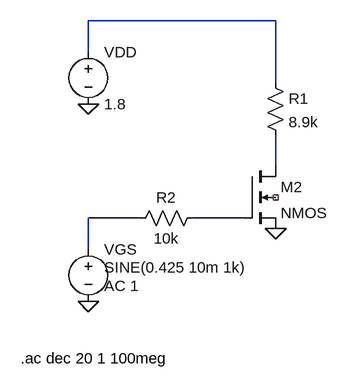
[diagram p0: schematic Common Source (CS) NMOS Amplifier.asc]
Common Source (CS) NMOS Amplifier.asc, the LTspice schematic file:
Version 4.1
SHEET 1 880 680
WIRE 160 -112 -128 -112
WIRE -128 -64 -128 -112
WIRE 160 -16 160 -112
WIRE 160 112 160 64
WIRE -48 192 -128 192
WIRE 112 192 32 192
WIRE -128 240 -128 192
FLAG 160 208 0
FLAG -128 320 0
FLAG -128 16 0
SYMBOL res 144 -32 R0
SYMATTR InstName R1
SYMATTR Value 8.9k
SYMBOL voltage -128 224 R0
WINDOW 3 24 44 Left 2
WINDOW 123 24 72 Left 2
WINDOW 39 24 100 Left 2
SYMATTR InstName VGS
SYMATTR Value SINE(0.425 10m 1k)
SYMATTR Value2 AC 1
SYMBOL voltage -128 -80 R0
WINDOW 123 0 0 Left 0
WINDOW 39 0 0 Left 0
SYMATTR InstName VDD
SYMATTR Value 1.8
SYMBOL nmos4 112 112 R0
SYMATTR InstName M2
SYMATTR Value2 l=0.18u w=10u
SYMBOL res 48 176 R90
WINDOW 0 0 56 VBottom 2
WINDOW 3 32 56 VTop 2
SYMATTR InstName R2
SYMATTR Value 10k
TEXT -232 408 Left 2 !.ac dec 20 1 100meg

The netlist it stands for:
* Common Source (CS) NMOS Amplifier.asc
R1 N001 N002 8.9k
VGS N003 0 SINE(0.425 10m 1k) AC 1
VDD N001 0 1.8
M2 N002 N004 0 NC_01 NMOS l=0.18u w=10u
R2 N004 N003 10k
.model NMOS NMOS
.model PMOS PMOS
.lib standard.mos
.ac dec 20 1 100meg
.backanno
.end